# Altium schematic sheet [05].GSM.SchDoc
size A; Organization: Altium Limited; Address1: L3, 12a Rodborough Rd; Address2: Frenchs Forest; Address3: NSW; Address4: Australia 2086
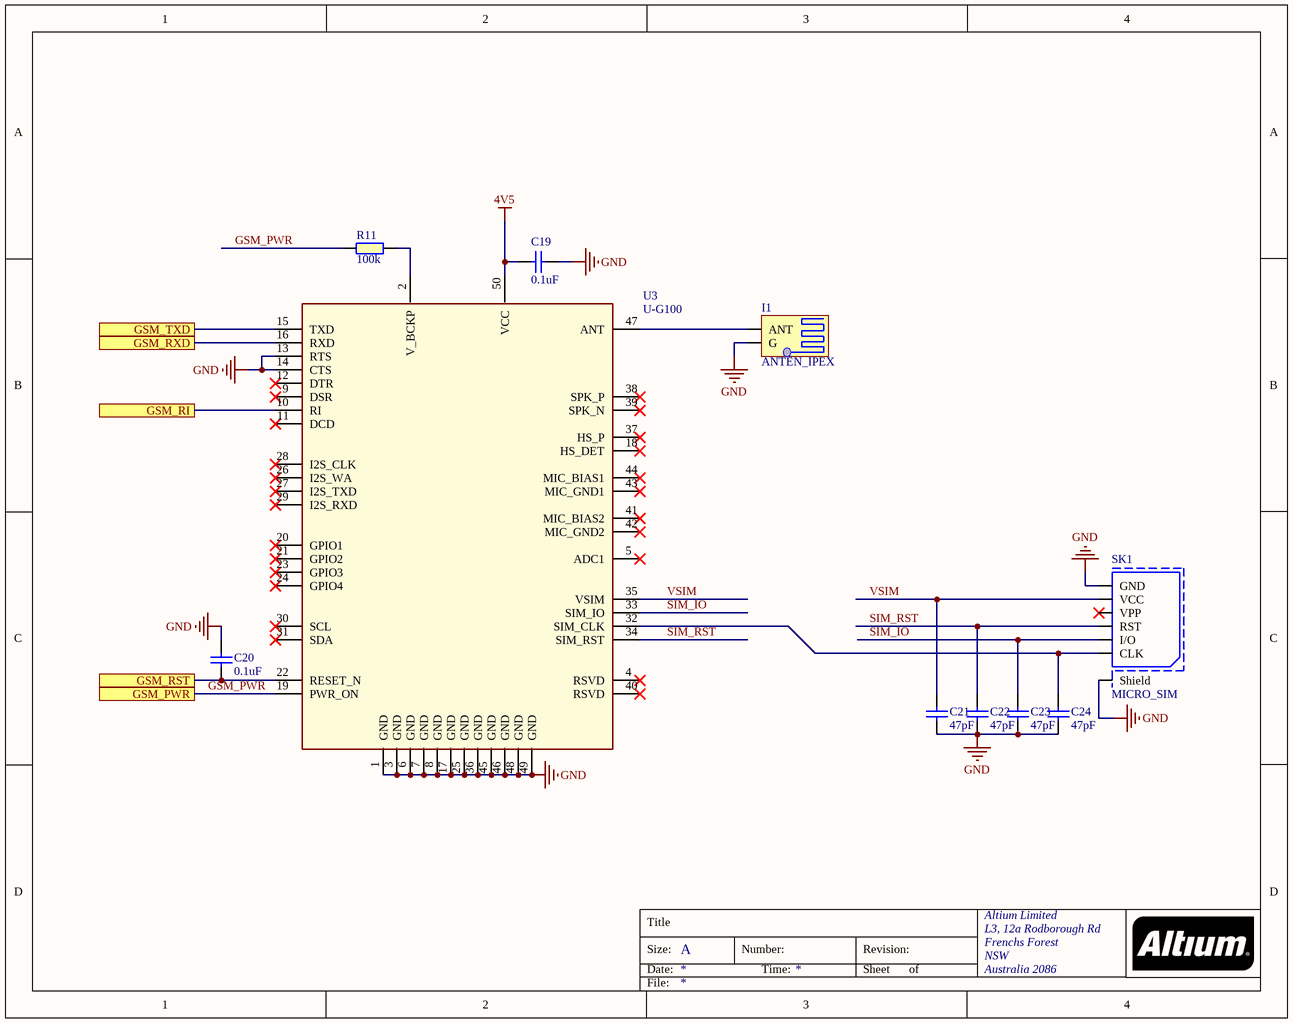
[diagram p0: [05].GSM.SchDoc]

## Parts
C19  0.1uF  [C_0603]
C20  0.1uF  [C_0603]
C21  47pF  [C_0603]
C22  47pF  [C_0603]
C23  47pF  [C_0603]
C24  47pF  [C_0603]
I1  ANTEN_IPEX  [ANTEN_IPEX]
R11  100k  [R_0603]
SK1  MICRO_SIM  [MICRO_SIM]
U3  U-G100  [G100_UBLOX]

## Ports
GSM_PWR, GSM_RI, GSM_RST, GSM_RXD, GSM_TXD

## Nets
4V5: C19.2 U3.50(VCC)
GND: C19.1 C20.1 C21.1 C22.1 C23.1 C24.1 I1.2(G) SK1.C5(GND) SK1.SH1(Shield) U3.1(GND) U3.3(GND) U3.6(GND) U3.7(GND) U3.8(GND) U3.13(RTS) U3.14(CTS) U3.17(GND) U3.25(GND) U3.36(GND) U3.45(GND) U3.46(GND) U3.48(GND) U3.49(GND)
GSM_PWR: R11.1 U3.19(PWR_ON) ; port GSM_PWR
GSM_RI: U3.10(RI) ; port GSM_RI
GSM_RST: C20.2 U3.22(RESET_N) ; port GSM_RST
GSM_RXD: U3.16(RXD) ; port GSM_RXD
GSM_TXD: U3.15(TXD) ; port GSM_TXD
SIM_IO: C23.2 SK1.C7(I/O) U3.33(SIM_IO)
SIM_RST: C22.2 SK1.C2(RST) U3.34(SIM_RST)
VSIM: C21.2 SK1.C1(VCC) U3.35(VSIM)
NetC24_2: C24.2 SK1.C3(CLK) U3.32(SIM_CLK)
NetI1_1: I1.1(ANT) U3.47(ANT)
NetR11_2: R11.2 U3.2(V_BCKP)

Not connected (* = marked no-connect by the designer): SK1 C6(VPP)*; U3 4(RSVD)* 5(ADC1)* 9(DSR)* 11(DCD)* 12(DTR)* 18(HS_DET)* 20(GPIO1)* 21(GPIO2)* 23(GPIO3)* 24(GPIO4)* 26(I2S_WA)* 27(I2S_TXD)* 28(I2S_CLK)* 29(I2S_RXD)* 30(SCL)* 31(SDA)* 37(HS_P)* 38(SPK_P)* 39(SPK_N)* 40(RSVD)* 41(MIC_BIAS2)* 42(MIC_GND2)* 43(MIC_GND1)* 44(MIC_BIAS1)*

## Notes on the sheet
- Title
- Size:
- Date:
- A
- Number:
- Time:
- Revision:
- Sheet
- of
- File:

## Library data of the parts
C19-C24 = CAP_0805
R11 = RES_0603